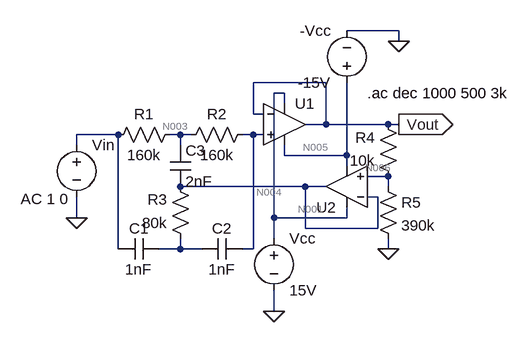
[diagram p0: schematic Q3.asc]
Q3.asc, the LTspice schematic file:
Version 4
SHEET 1 880 680
WIRE 544 -96 464 -96
WIRE 544 -80 544 -96
WIRE 432 -16 320 -16
WIRE 368 0 352 0
WIRE 368 16 368 0
WIRE 320 32 320 -16
WIRE 336 32 320 32
WIRE 432 48 432 -16
WIRE 432 48 400 48
WIRE 528 48 432 48
WIRE 544 48 528 48
WIRE 112 64 48 64
WIRE 208 64 192 64
WIRE 224 64 208 64
WIRE 320 64 304 64
WIRE 336 64 320 64
WIRE 48 80 48 64
WIRE 208 80 208 64
WIRE 368 96 368 80
WIRE 464 96 464 -16
WIRE 464 96 368 96
WIRE 464 112 464 96
WIRE 528 128 496 128
WIRE 400 144 208 144
WIRE 432 144 400 144
WIRE 528 144 528 128
WIRE 512 160 496 160
WIRE 48 192 48 160
WIRE 352 192 352 0
WIRE 464 192 464 176
WIRE 464 192 352 192
WIRE 400 208 400 144
WIRE 512 208 512 160
WIRE 512 208 400 208
WIRE 352 224 352 192
WIRE 112 240 112 64
WIRE 208 240 208 224
WIRE 208 240 176 240
WIRE 240 240 208 240
WIRE 320 240 320 64
WIRE 320 240 304 240
WIRE 528 240 528 224
WIRE 352 336 352 304
FLAG 528 240 0
FLAG 544 -80 0
FLAG 352 336 0
FLAG 48 192 0
FLAG 544 48 Vout
IOPIN 544 48 Out
SYMBOL Opamps\\UniversalOpamp2 368 48 R0
SYMATTR InstName U1
SYMBOL Opamps\\UniversalOpamp2 464 144 R180
SYMATTR InstName U2
SYMBOL voltage 352 208 R0
WINDOW 123 0 0 Left 0
WINDOW 39 0 0 Left 0
SYMATTR InstName Vcc
SYMATTR Value 15V
SYMBOL voltage 48 64 R0
WINDOW 123 -86 99 Left 2
WINDOW 39 0 0 Left 0
SYMATTR InstName Vin
SYMATTR Value ""
SYMATTR Value2 AC 1 0
SYMBOL res 208 48 R90
WINDOW 0 0 56 VBottom 2
WINDOW 3 32 56 VTop 2
SYMATTR InstName R1
SYMATTR Value 160k
SYMBOL res 320 48 R90
WINDOW 0 0 56 VBottom 2
WINDOW 3 32 56 VTop 2
SYMATTR InstName R2
SYMATTR Value 160k
SYMBOL res 224 240 R180
WINDOW 0 36 76 Left 2
WINDOW 3 36 40 Left 2
SYMATTR InstName R3
SYMATTR Value 80k
SYMBOL res 544 144 R180
WINDOW 0 36 76 Left 2
WINDOW 3 36 40 Left 2
SYMATTR InstName R4
SYMATTR Value 10k
SYMBOL res 512 128 R0
SYMATTR InstName R5
SYMATTR Value 390k
SYMBOL cap 176 224 R90
WINDOW 0 0 32 VBottom 2
WINDOW 3 32 32 VTop 2
SYMATTR InstName C1
SYMATTR Value 1nF
SYMBOL cap 304 224 R90
WINDOW 0 0 32 VBottom 2
WINDOW 3 32 32 VTop 2
SYMATTR InstName C2
SYMATTR Value 1nF
SYMBOL cap 192 80 R0
SYMATTR InstName C3
SYMATTR Value 2nF
SYMBOL voltage 464 0 R180
WINDOW 0 24 96 Left 2
WINDOW 3 24 16 Left 2
SYMATTR InstName -Vcc
SYMATTR Value -15V
TEXT 496 0 Left 2 !.ac dec 1000 500 3k

The netlist it stands for:
* Q3.asc
XU1 N004 Vout N001 N005 Vout level.2 Avol=1Meg GBW=10Meg Slew=10Meg ilimit=25m rail=0 Vos=0 phimargin=45 en=0 enk=0 in=0 ink=0 Rin=500Meg  ; pins IN+ IN- V+ V- OUT
XU2 N006 N007 N001 N005 N007 level.2 Avol=1Meg GBW=10Meg Slew=10Meg ilimit=25m rail=0 Vos=0 phimargin=45 en=0 enk=0 in=0 ink=0 Rin=500Meg  ; pins IN+ IN- V+ V- OUT
Vcc N001 0 15V
Vin N002 0 AC 1 0
R1 N003 N002 160k
R2 N004 N003 160k
R3 N008 N007 80k
R4 N006 Vout 10k
R5 N006 0 390k
C1 N008 N002 1nF
C2 N004 N008 1nF
C3 N003 N007 2nF
V§-Vcc N005 0 -15V
.ac dec 1000 500 3k
.lib UniversalOpamps2.sub
.backanno
.end

* Results of the author's LTspice run, read from the files saved beside the schematic
* Operating Point, zero values left out:
*   V(n001) = 15 V
*   V(n005) = -15 V
*   I(-vcc) = 2.997 mA
*   I(Vcc) = -2.997 mA
*   Ix(u1:3) = 1.498 mA
*   Ix(u1:4) = -1.498 mA
*   Ix(u2:3) = 1.498 mA
*   Ix(u2:4) = -1.498 mA
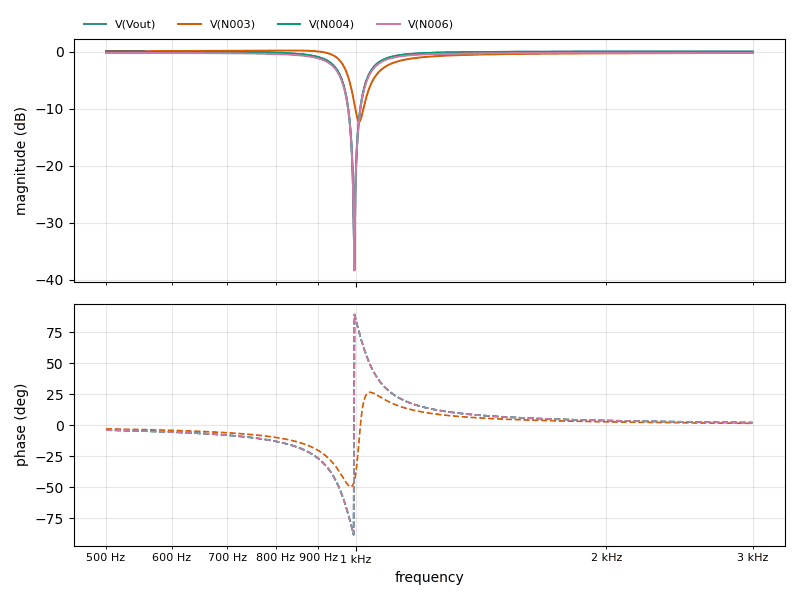
[diagram p1: AC Analysis of Q3.asc, plotted from the saved traces]
* AC Analysis, 1 run:
*   V(Vout): -0.03 dB at 500 Hz, -0.01 dB at 3 kHz, peak -0.01 dB at 3 kHz, 3 dB below the peak at 1.046 kHz
*   V(N003): 0.05 dB at 500 Hz, -0.26 dB at 3 kHz, peak 0.19 dB at 824.1 Hz, 3 dB below the peak at 968.2 Hz
*   V(N004): -0.03 dB at 500 Hz, -0.01 dB at 3 kHz, peak -0.01 dB at 3 kHz, 3 dB below the peak at 1.046 kHz
*   V(N006): -0.25 dB at 500 Hz, -0.23 dB at 3 kHz, peak -0.23 dB at 3 kHz, 3 dB below the peak at 1.046 kHz